# EAGLE design finger_jlink_r1.4 (EAGLE 9.5.1)
CHECKED: 2019.11.02; COMPANY: NeKuNeKo Inc. Github: @nekuneko; DATE: 2019.11.02; DRAWN: A; DRGNO: 1993; REV: 1.4
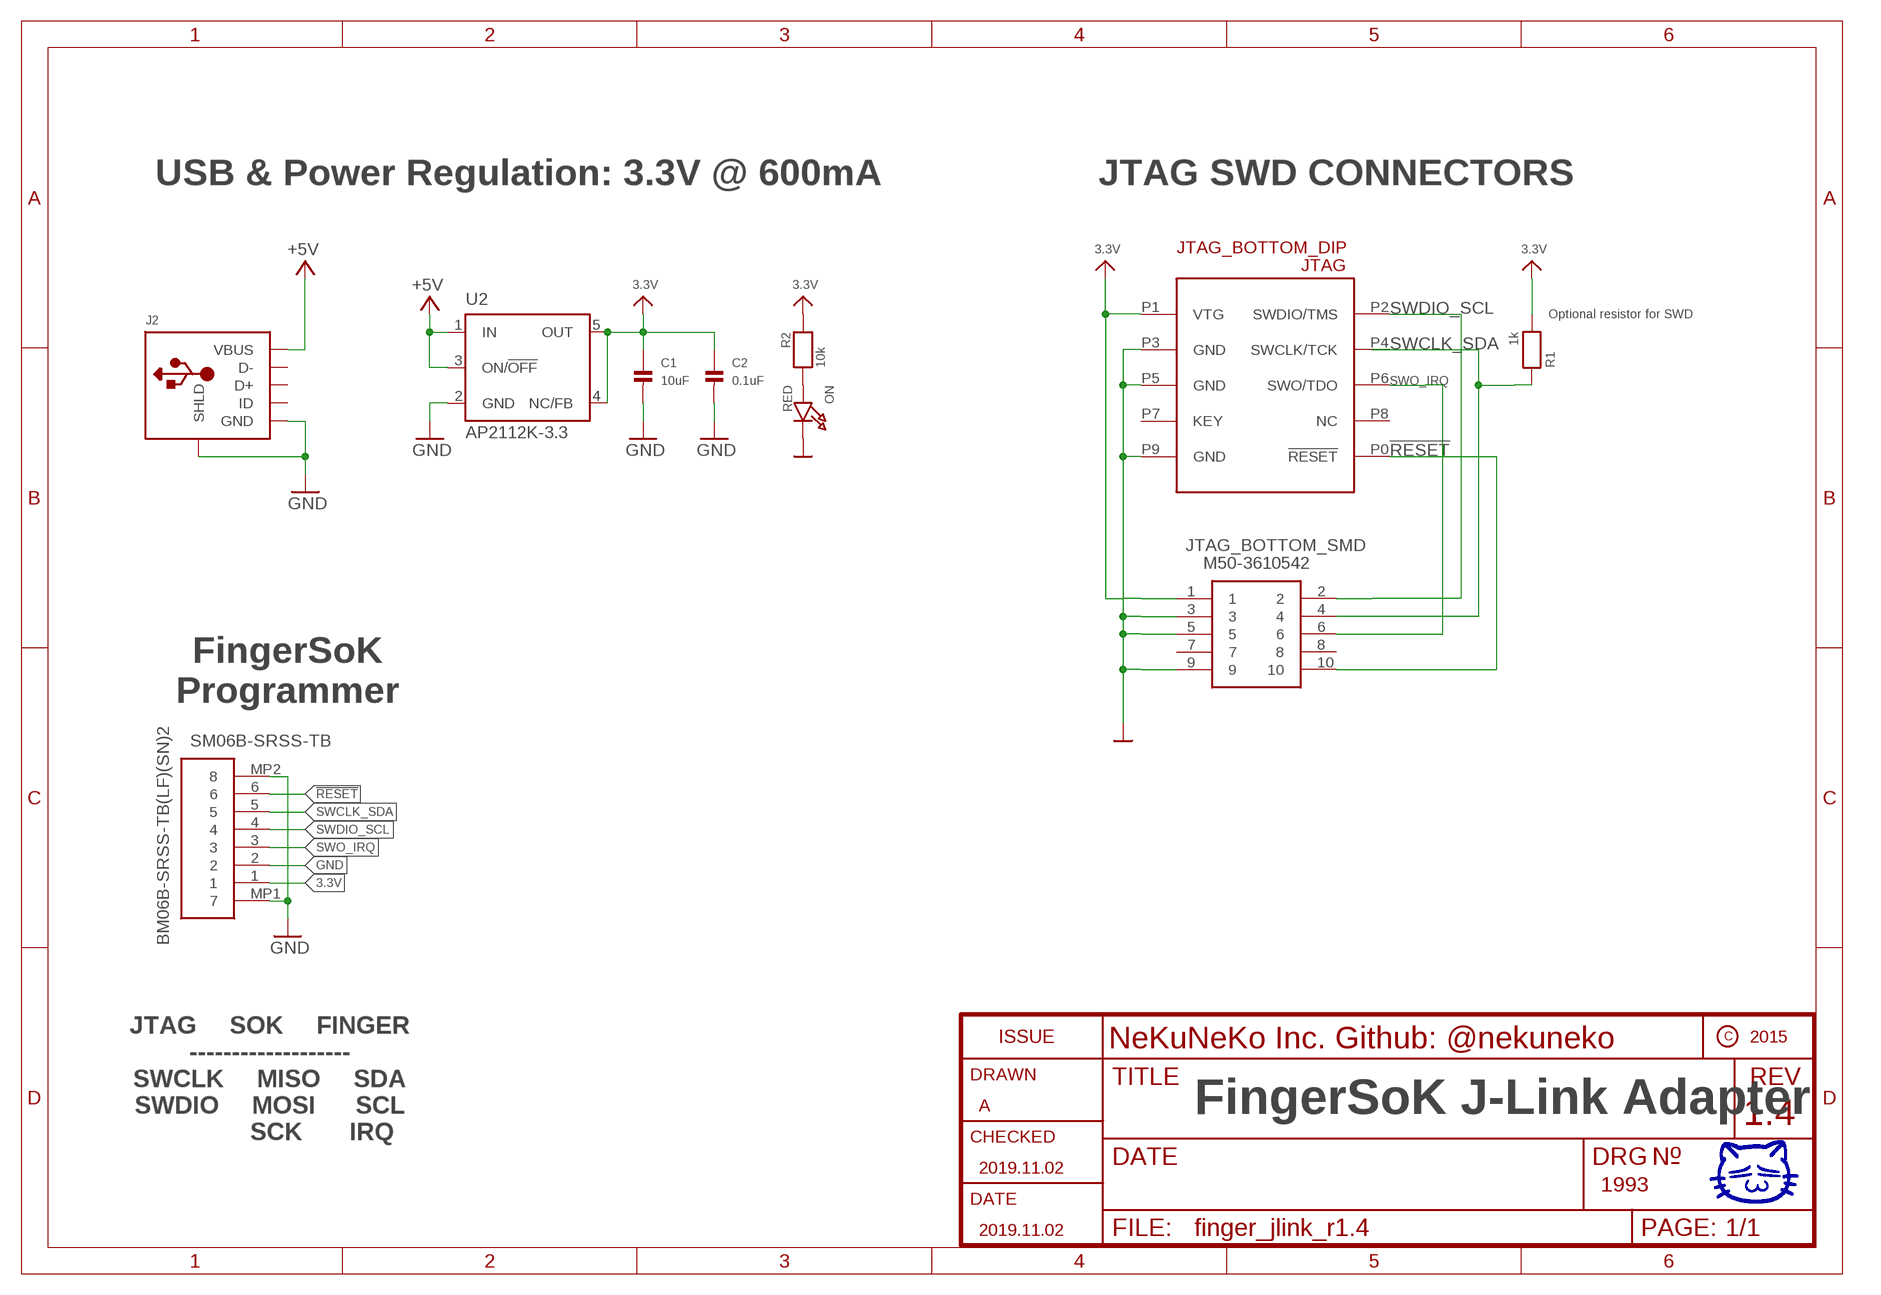
[diagram p0: schematic, sheet 1]

## Parts
C1  10uF  CAP_CERAMIC_0402  [_0402]
C2  0.1uF  CAP_CERAMIC_0402  [_0402]
J2  FLAT_MICROUSB_ALIEXPRESS_TYPE_4  [USB_TYPE_4_105164-0001]
JTAG_BOTTOM_DIP  JTAGICE3-CONNECTOR50MIL-THT  [JTAGICE3-50MIL]
JTAG_BOTTOM_SMD  M50-3610542  [M503610542]
ON  RED  LED0603  [CHIPLED_0603]
R1  1k  RESISTOR_0402  [_0402]
R2  10k  RESISTOR_0402  [_0402]
SM06B-SRSS-TB  BM06B-SRSS-TB(LF)(SN)2  [BM06B-SRSS-TB(LF)(SN)_2]
U2  AP2112K-3.3  LP2985-XXDBVR33  [SOT23-DBV]

## Nets
3.3V: C1.1 C2.1 JTAG_BOTTOM_DIP.P1(VTG) JTAG_BOTTOM_SMD.1 R1.2 R2.2 SM06B-SRSS-TB.1 U2.4(NC/FB) U2.5(OUT)
!RESET: JTAG_BOTTOM_DIP.P0(!RESET) JTAG_BOTTOM_SMD.10 SM06B-SRSS-TB.6
+5V [usbvcc]: J2.P$5(VBUS) U2.1(IN) U2.3(ON/!OFF)
GND: C1.2 C2.2 J2.P$1(GND) J2.P$8(SHLD) J2.P$9(SHLD) JTAG_BOTTOM_DIP.P3(GND) JTAG_BOTTOM_DIP.P5(GND) JTAG_BOTTOM_DIP.P9(GND) JTAG_BOTTOM_SMD.3 JTAG_BOTTOM_SMD.5 JTAG_BOTTOM_SMD.9 ON.C SM06B-SRSS-TB.2 SM06B-SRSS-TB.MP1 SM06B-SRSS-TB.MP2 U2.2(GND)
N$1: ON.A R2.1
SWCLK_SDA: JTAG_BOTTOM_DIP.P4(SWCLK/TCK) JTAG_BOTTOM_SMD.4 R1.1 SM06B-SRSS-TB.5
SWDIO_SCL: JTAG_BOTTOM_DIP.P2(SWDIO/TMS) JTAG_BOTTOM_SMD.2 SM06B-SRSS-TB.4
SWO_IRQ: JTAG_BOTTOM_DIP.P6(SWO/TDO) JTAG_BOTTOM_SMD.6 SM06B-SRSS-TB.3
Unconnected: J2.P$2(ID) J2.P$3(D+) J2.P$4(D-) JTAG_BOTTOM_DIP.P7(KEY) JTAG_BOTTOM_DIP.P8(NC) JTAG_BOTTOM_SMD.7 JTAG_BOTTOM_SMD.8

## Notes on the sheet
- USB & Power Regulation: 3.3V @ 600mA | JTAG SWD CONNECTORS
- Optional resistor for SWD
- FingerSoK
  Programmer
- JTAG ⇆ SOK ⇆ FINGER
  -------------------
  SWCLK ⇆ MISO ⇆ SDA
   SWDIO ⇆ MOSI ⇆  SCL 
                  SCK  ⇆  IRQ
- FingerSoK J-Link Adapter

## Library data of the parts
C1 C2 = microbuilder:CAP_CERAMIC: Ceramic Capacitors 0402 - 0402 Surface Mount Capacitors 16pF 50V 5% [Digikey: 445-4899-2-ND] 18pF 50V 5% [Digikey: 490-1281-2-ND] 22pF 50V 5% [Digikey: 490-1283-2-ND] 68pF 50V 5% [Digikey: 490-1289-2-ND] 0.1uF 10V 10% [Digikey: 490-1318-2-ND] 1.0uF 6.3V 10% [Digikey: 490-1320-2-ND] 0603 - 0603 Surface Mount Capacitors 16 pF 50V 5% [Digikey: 445-5051-2-ND] 22 pF 50V [Digikey: PCC220ACVTR-ND] 33 pF 50V 5% [Digikey: 490-1415-1-ND] 56pF 50V 5% [Digikey: 490-1421-1-ND] 220pF 50V 5% [Digikey: 445-1285-1-ND] 680 pF 50V 2200 pF 50V 5% C0G [Digikey: 445-1297-1-ND] 5600 pF 100V 5% X7R [Digikey: 478-3711-1-ND] 0.1 µF 25V 10% [Digikey: PCC2277TR-ND] 0.22 µF 16V 10% X7R [Digikey: 445-1318-1-ND] 1.0 µF 25V 10% [Digikey: 445-5146-2-ND] 0603 - RF Specific 3pF 250V +/-0.1pF RF [Digikey: 712-1347-1-ND] 18 pF 250V 5% [Digikey: 478-3505-1-ND or 712-1322-1-ND] 56 pF 250V 5% C0G RF [Digikey: 490-4867-1-ND] 68 pF 250V RF [Digikey: 490-4868-1-ND] 0805 - 0805 Surface Mount Capacitors 220 pF 250V 2% RF Ceramic Capacitor [Digikey: 712-1398-1-ND] 1000 pF 50V 2% NP0 Ceramic Capacitor [Digikey: 478-3760-1-ND] 0.1 µF 25V 10% Ceramic Capacitor [Digikey: PCC1828TR-ND] 1.0 µF 16V 10% Ceramic Capacitor[Digikey: 490-1691-2-ND] 10.0 µF 10V 10% Ceramic Capacitor[Digikey: 709-1228-1-ND] 10.0 uF 16V 10% Ceramic Capacitor [Digikey: 478-5165-2-ND] 47 uF 6.3V 20% Ceramic Capacitor [Digikey: 587-1779-1-ND or 399-5506-1-ND] 1206 - 1206 Surface Mount Capacitors 47uF 10V 20% Ceramic Capacitor [Digikey: 490-5528-1-ND or 399-5508-1-ND or 445-6010-1-ND] 100uF 6.3V -20%, +80% Y5V Ceramic Capacitor (Digikey: 490-4512-1-ND, Mouser: 81-GRM31CF50J107ZE1L)
J2 = 0SoK:FLAT_MICROUSB_ALIEXPRESS: Flat micro usb connector - from Aliexpress Material: Housing: High temperature thermoplastic with g.f,UL94v-0 Contact: copper alloy, t=0.20mm Shell: copper alloy, t=0.25mm Specification: Current rating: 1A Max. Dielectric withstanding voltage: 100 V(ac) for 1 min. Contact resistance: 50 mW Max. Insultarion resistance: 100 MW Min. Total mating force: 3.57 Kgf Max. Total unmating force: 1.0 Kgf Min. 0.81~2.05 Kgf Min. Operating Temperature: -30°C to 80°C Aliexpress: https://es.aliexpress.com/item/Free-shipping-10pcs-lot-Micro-USB-connector-B-type-female-jack-DIP-5Pin-4FEET-FLAT-MOUTH/32722418214.html
JTAG_BOTTOM_DIP = 0SoK:JTAGICE3-CONNECTOR: JTAG Connector for JTAGICE3 Designed originally by Michael Hohl <https://www.michaelhohl.net/> in May 2013. Edit in July 2019 by NekuNeko <https://github.com/nekuneko//>. You are free to use, edit and distribute this library.
JTAG_BOTTOM_SMD = SamacSys_Parts:M50-3610542: HARWIN - M50-3610542 - CONNECTOR, HEADER, 10POS, 2ROW, 1.27MM Source: Datasheet <https://cdn.harwin.com/pdfs/M50-361.pdf>; DESCRIPTION: HARWIN - M50-3610542 - CONNECTOR, HEADER, 10POS, 2ROW, 1.27MM; HEIGHT: 5.03mm; MANUFACTURER_NAME: HARWIN; MANUFACTURER_PART_NUMBER: M50-3610542; MOUSER_PART_NUMBER: 855-M50-3610542; MOUSER_PRICE-STOCK: https://www.mouser.com/Search/Refine.aspx?Keyword=855-M50-3610542
ON = microbuilder:LED: LED 0603 - 0603 Surface Mount Package 2mA: Green LED - Low Power (3.9mcd, 2ma, 1.7Vf) - Digikey: 475-2709-2-ND Orange LED - Low Power (9.8mcd, 2ma, 1.8Vf) - Digikey: 475-1194-2-ND Red LED - Low Power (5mcd, 2ma, 1.8Vf) - Digikey: 475-1195-2-ND Yellow LED - Low Power (7mcd, 2ma, 1.8Vf) - Digikey: 475-1196-2-ND 5mA: Blue LED - Low Power (17mcd, 5ma, 2.9Vf) - Digikey: LNJ937W8CRACT-ND 0805 - 0805 Surface Mount Package 2mA: Red LED (8.8mcd, 2mA, 1.8Vf, Clear) - Low Power [Digikey: 475-2510-1-ND] Green LED (5mcd, 2mA, 1.8Vf, Clear) - Low Power [Digikey: 475-2730-1-ND] Yellow LED (11.3mcd, 2mA, 1.8Vf, Clear) - Low Power [Digikey: 475-2555-1-ND] 20mA: Red LED (104mcd, 20mA, Diffused) - LS R976 [Digikey: 475-1278-6-ND] Red LED (12mcd, 20mA, 2.0Vf, Clear) - APT2012EC [Digikey: 754-1128-1-ND] Green LED (15mcd, 20mA, 2.2Vf, Clear) - APT2012GC [Digikey: 754-1131-1-ND] Orange LED (160mcd, 20mA, 2.1Vf, Clear) - APT2012SECK [Digikey: 754-1130-1-ND] 1206 - 1206 Surface Mount Package Green LED (26mcd, 20mA, Diffused) - LG N971 [Digikey: 475-1407-6-ND] Red LED (15mcd, 20mA, Diffused) - LH N974 [Digikey: 475-1416-6-ND]
R1 R2 = microbuilder:RESISTOR: Resistors 0402 - 0402 Surface Mount Package 22 Ohm 1% 1/16W [Digikey: 311-22.0LRTR-ND] 33 Ohm 5% 1/16W 1.0K 5% 1/16W 1.5K 5% 1/16W 2.0K 1% 1/16W 10.0K 1% 1/16W [Digikey: 311-10.0KLRTR-ND] 10.0K 5% 1/16W [Digikey: RMCF0402JT10K0TR-ND] 12.1K 1% 1/16W [Digikey: 311-22.0LRTR-ND] 100.0K 5% 1/16W 0603 - 0603 Surface Mount Package 0 Ohm 1/10 Watt 1% Resistor 15 Ohm 1/10 Watt 1% Resistor 33 Ohm 1/10 Watt 1% Resistor 49.9 Ohm 1/10 Watt 1% Resistor 100 Ohm 1/10 Watt 1% Resistor 150 Ohm 1/10 Watt 1% Resistor 240 Ohm 1/10 Watt 1% Resistor 390 Ohm 1/10 Watt 1% Resistor 560 Ohm 1/10 Watt 1% Resistor 680 Ohm 1/10 Watt 1% Resistor 750 Ohm 1/10 Watt 1% Resistor 1.0K Ohm 1/10 Watt 1% Resistor 1.5K Ohm 1/10 Watt 1% Resistor 2.0K Ohm 1/10 Watt 1% Resistor 2.2K Ohm 1/10 Watt 1% Resistor 3.3K Ohm 1/10 Watt 1% Resistor 4.7K Ohm 1/10 Watt 1% Resistor 10.0K Ohm 1/10 Watt 1% Resistor 12.0K Ohm 1/10 Watt 1% Resistor 12.1K Ohm 1/10 Watt 1% Resistor 20.0K Ohm 1/10 Watt 1% Resistor 33.0K Ohm 1/10 Watt 1% Resistor 100.0K Ohm 1/10 Watt 1% Resistor 0805 - 0805 Surface Mount Package 0 Ohm 1/8 Watt 1% Resistor 33 Ohm 1/8 Watt 1% Resistor 100 Ohm 1/8 Watt 1% Resistor 150 Ohm 1/8 Watt 1% Resistor 200 Ohm 1/8 Watt 1% Resistor 240 Ohm 1/8 Watt 1% Resistor 330 Ohm 1/8 Watt 1% Resistor 390 Ohm 1/8 Watt 1% Resistor 470 Ohm 1/8 Watt 1% Resistor 1.0K Ohm 1/8 Watt 1% Resistor 1.5K Ohm 1/8 Watt 1% Resistor 2.0K Ohm 1/8 Watt 1% Resistor 4.7K Ohm 1/8 Watt 1% Resistor 5.1K Ohm 1/8 Watt 1% Resistor 5.6K Ohm 1/8 Watt 1% Resistor 10.0K Ohm 1/8 Watt 1% Resistor 22.0K Ohm 1/8 Watt 1% Resistor 33.0K Ohm 1/8 Watt 1% Resistor 100K Ohm 1/8 Watt 1% Resistor 1206 - 1206 Surface Mount Package 2012 - 2010 Surface Mount Package 0.11 Ohm 1/2 Watt 1% Resistor - Digikey: RHM.11UCT-ND
SM06B-SRSS-TB = 0SoK:BM06B-SRSS-TB(LF)(SN): connector,multipole PCB use,BM06B-SRSS-T JST SH Series, 1mm Pitch 6 Way 1 Row Straight PCB Header, Solder Termination, 1A Source: Datasheet <http://docs-emea.rs-online.com/webdocs/13ce/0900766b813ce45e.pdf>
U2 = SmartPrj:LP2985-XXDBVR: ULTRALOW-POWER 50-mA LOW-DROPOUT LINEAR REGULATORS 50-mA Low-Dropout Regulator Source: http://focus.ti.com/lit/ds/symlink/tps77001.pdf

## Board
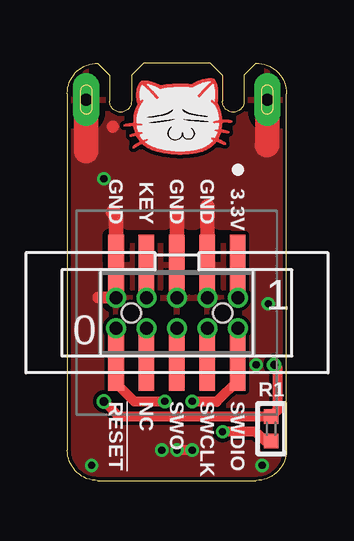
[diagram p1: board, top side]
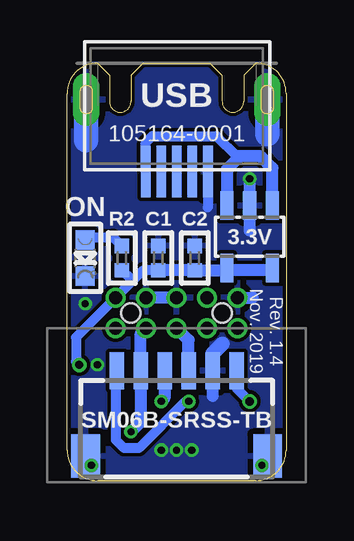
[diagram p2: board, bottom side, seen from below]

Size 9.14 x 17.4 mm. Coordinates in mm from the lower left corner, seen from the top.
Outline: 7.87,17.4 arc-90 9.14,16.13 9.14,1.27 arc-90 7.87,0 1.27,0 arc-90 0,1.27 0,16.13 arc-90 1.27,17.4
Copper layers (1*16): Top 0.035559375mm / dielectric 1.6mm / Bottom 0.035559375mm
Design rules "nekuneko": minimum track width 6mil, minimum drill 0.3mm, track to track 6mil, track to pad 6mil, pad to pad 6mil, via to via 6mil, smd to smd 6mil, copper to edge 6mil, drill to drill 6mil, minimum pad ring 5mil, minimum via ring 5mil, stop-mask expansion 2.5mil, vias tented up to drill 20mil, thermal gap 10mil
tRestrict: 3 lines
bRestrict: 1 lines

### Footprints (pad centres in the part's own frame; a part is rotated, then mirrored left to right if it is on the bottom)
_0402 = smd 0.6 x 0.6: 1 -0.508,0; 2 0.508,0
USB_TYPE_4_105164-0001 = smd 0.4 x 2.15: P$1 4.9,-0.33; P$2 4.25,-0.33; P$3 3.6,-0.33; P$4 2.95,-0.33; P$5 2.3,-0.33 | drill 0.5 pad 1.1 long: P$8 -0.175,2.667; P$9 7.375,2.667
JTAGICE3-50MIL = drill 0.55: P0 -2.54,-0.635; P1 2.54,0.635; P2 2.54,-0.635; P3 1.27,0.635; P4 1.27,-0.635; P5 0,0.635; P6 0,-0.635; P7 -1.27,0.635; P8 -1.27,-0.635; P9 -2.54,0.635
M503610542 = smd 0.65 x 2.5: 1 -2.54,-2; 2 -2.54,2; 3 -1.27,-2; 4 -1.27,2; 5 0,-2; 6 0,2; 7 1.27,-2; 8 1.27,2; 9 2.54,-2; 10 2.54,2 | hole 0.8: -1.905,0; 1.905,0
CHIPLED_0603 = smd 0.8 x 0.8: A 0,-0.75; C 0,0.75
BM06B-SRSS-TB(LF)(SN)_2 = smd 0.6 x 1.55: 1 -2.5,-1.65; 2 -1.5,-1.65; 3 -0.5,-1.65; 4 0.5,-1.65; 5 1.5,-1.65; 6 2.5,-1.65 | smd 1.2 x 1.8: MP1 -3.8,1.9; MP2 3.8,1.9
SOT23-DBV = smd 0.55 x 1.2: 1 -0.95,-1.3; 2 0,-1.3; 3 0.95,-1.3; 4 0.95,1.3; 5 -0.95,1.3

### Placement (x,y rotation side)
C1  5.33,9.27 90 bottom
C2  3.81,9.27 90 bottom
J2  8.16,13.21 0 bottom
JTAG_BOTTOM_DIP  4.57,6.99 0 top
JTAG_BOTTOM_SMD  4.57,6.99 180 top
ON  8.38,9.27 180 bottom
R1  8.51,2.16 90 top
R2  6.86,9.27 270 bottom
SM06B-SRSS-TB  4.57,2.92 180 bottom
U2  1.52,10.16 180 bottom
U$4  [NEKO_5_3_WHITEFACE]  2.35,13.59 0 top
U$5  [USB_TYPE_4_DIM]  7.87,17.4 0 bottom

### Tracks (layer width: path | path; a pad name or v marks a point on that pad's centre or on a via)
3.3V  (via drill 0.35)
  Top 0.406: v1.52,3.3 2.16,2.67 R1.2 8.76,2.92 8.76,4.7 v8.64,4.83
  Top 0.61: JTAG_BOTTOM_SMD.1 JTAG_BOTTOM_DIP.P1
  Bottom 0.406: C1.1 5.97,8.76 6.35,8.38 | 6.35,8.38 JTAG_BOTTOM_DIP.P1 8.76,5.97 8.76,4.95 v8.64,4.83 | v1.52,3.3 2.07,3.85 SM06B-SRSS-TB.1 | 0.64,8.8 U2.5 | R2.2 6.48,8.38 6.35,8.38
  Bottom 0.508: U2.5 0.58,8.85 0.67,8.76 2.54,8.76 | U2.4 2.56,8.78 2.54,8.76 | 2.54,8.76 C2.1 C1.1 | SM06B-SRSS-TB.1 2.07,5.08
!RESET  (via drill 0.3)
  Top 0.406: JTAG_BOTTOM_SMD.10 2.03,4.06 2.79,3.3 v4.06,3.3
  Top 0.61: JTAG_BOTTOM_SMD.10 JTAG_BOTTOM_DIP.P0
  Bottom 0.406: SM06B-SRSS-TB.6 7.11,4.53 7.11,1.7 6.76,1.35 6.14,1.35 4.19,3.3 v4.06,3.3 | v4.06,3.3
+5V
  Bottom 0.406: 5.87,12.13 J2.P$5 5.87,14.07 5.59,14.35 2.9,14.35 2.06,13.51 2,13.45
  Bottom 0.508: U2.1 0.57,13.02 1.06,13.51 2.06,13.51 | 2,13.45 2.47,12.97 U2.3
GND  (via drill 0.3)
  Top 0.406: v5.21,1.27 v4.57,1.27
  Top 0.508: 0.79,13.73 0.93,13.59 | 1.91,14.76 1.91,14.73 | JTAG_BOTTOM_DIP.P9 1.29,7.62
  Top 0.61: JTAG_BOTTOM_SMD.9 2.03,8.46 | JTAG_BOTTOM_DIP.P3 JTAG_BOTTOM_SMD.3 5.84,11.43 | JTAG_BOTTOM_DIP.P5 JTAG_BOTTOM_SMD.5 4.57,11.18 | JTAG_BOTTOM_SMD.9 JTAG_BOTTOM_DIP.P9 | JTAG_BOTTOM_SMD.9 2.03,11.05 1.91,11.18
  Top 1.016: J2.P$9 0.79,13.73 | J2.P$8 8.34,13.99 8.32,13.97
  Bottom 0.406: J2.P$1 3.27,11.38
  Bottom 0.508: 1.52,10.41 U2.2 v1.52,12.57 | JTAG_BOTTOM_DIP.P9 1.4,7.62 | 0.79,14.25 0.76,14.22 | 8.34,14.18 8.26,14.1 | JTAG_BOTTOM_DIP.P5 JTAG_BOTTOM_DIP.P3 | SM06B-SRSS-TB.2 3.07,3.53
  Bottom 0.61: SM06B-SRSS-TB.2 3.07,5.29 2.67,5.7
  Bottom 1.016: J2.P$9 0.79,14.43 | J2.P$8 8.34,14.18
  other vias: 3.94,1.27 7.87,4.83 8.38,7.37 8.13,0.64 1.02,0.64
  pour Top (isolate 0.012): 9.14,17.4 0,17.4 0,0 9.14,0
  pour Bottom (isolate 0.012): 9.14,17.4 0,17.4 0,0 0.25,0 9.14,0
N$1
  Bottom 0.406: R2.1 7.23,10.15 8.26,10.15 ON.A
SWCLK_SDA  (via drill 0.3)
  Top 0.406: R1.1 8.26,1.65 7.87,2.03 v6.48,2.03
  Top 0.61: JTAG_BOTTOM_SMD.4 JTAG_BOTTOM_DIP.P4
  Bottom 0.508: JTAG_BOTTOM_DIP.P4 6.07,6.12 SM06B-SRSS-TB.5 6.07,2.44 v6.48,2.03
SWDIO_SCL  (via drill 0.3)
  Top 0.406: JTAG_BOTTOM_SMD.2 7.11,4.17 6.22,3.28 5.23,3.28
  Top 0.508: 5.23,3.28 v5.21,3.3
  Top 0.61: JTAG_BOTTOM_SMD.2 JTAG_BOTTOM_DIP.P2
  Bottom 0.406: SM06B-SRSS-TB.4
  Bottom 0.508: SM06B-SRSS-TB.4 5.08,3.43 v5.21,3.3
SWO_IRQ
  Top 0.61: JTAG_BOTTOM_SMD.6 JTAG_BOTTOM_DIP.P6
  Bottom 0.508: SM06B-SRSS-TB.3 4.07,5.85 JTAG_BOTTOM_DIP.P6

### Text on the board
tPlace: GND | KEY | GND | GND | 3.3V | !RESET | NC | SWO | SWCLK | SWDIO
bPlace: USB | 105164-0001 | ON | 3.3V | Rev. 1.4 / Nov. 2019
tStop: FingerSoK | NeKuNeKo | J-LINK
bStop: FINGERSOK